# EAGLE design NFC-WiFi (EAGLE 9.1.3)
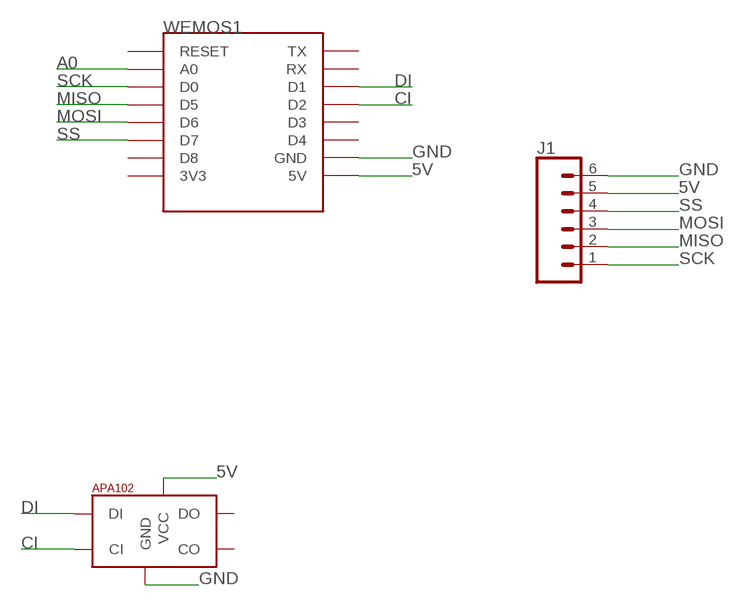
[diagram p0: schematic, sheet 1]

## Parts
J1  CONN_06SILK_FEMALE_PTH  [1X06]
U$1  APA1025050  [APA102_5050]
WEMOS1  WEMOS-D1-MINI  [WEMOS-D1-MINI]

## Nets
5V: J1.5 U$1.1(VCC) WEMOS1.5V
A0: WEMOS1.A0
CI: U$1.5(CI) WEMOS1.D2
DI: U$1.4(DI) WEMOS1.D1
GND: J1.6 U$1.6(GND) WEMOS1.GND
MISO: J1.2 WEMOS1.D5
MOSI: J1.3 WEMOS1.D6
SCK: J1.1 WEMOS1.D0
SS: J1.4 WEMOS1.D7
Unconnected: U$1.2(CO) U$1.3(DO) WEMOS1.3V3 WEMOS1.D3 WEMOS1.D4 WEMOS1.D8 WEMOS1.RESET WEMOS1.RX WEMOS1.TX

## Library data of the parts
J1 = SparkFun-Connectors:CONN_06: Multi connection point. Often used as Generic Header-pin footprint for 0.1 inch spaced/style header connections On any of the 0.1 inch spaced packages, you can populate with these: Break Away Headers - Straight <https://www.sparkfun.com/products/116> (PRT-00116) Break Away Male Headers - Right Angle <https://www.sparkfun.com/products/553> (PRT-00553) Female Headers <https://www.sparkfun.com/products/115> (PRT-00115) Break Away Headers - Machine Pin <https://www.sparkfun.com/products/117> (PRT-00117) Break Away Female Headers - Swiss Machine Pin <https://www.sparkfun.com/products/743> (PRT-00743) Arduino Stackable Header - 6 Pin <https://www.sparkfun.com/products/9280> (PRT-09280) For SCREWTERMINALS and SPRING TERMINALS visit here: Screw Terimnals on SparkFun.com <https://www.sparkfun.com/search/results?term=Screw+Terminals> (5mm/3.5mm/2.54mm spacing) This device is also useful as a general connection point to wire up your design to another part of your project. Our various solder wires solder well into these plated through hole pads. Hook-Up Wire - Assortment (Stranded, 22 AWG) <https://www.sparkfun.com/products/11375> (PRT-11375) Hook-Up Wire - Assortment (Solid Core, 22 AWG) <https://www.sparkfun.com/products/11367> (PRT-11367) View the entire wire category on our website here <https://www.sparkfun.com/categories/141>; PROD_ID: CONN-08437
U$1 = jos-ph:APA102: APA102C 5050 RGB LED -- Adafruit DotStar Single LED Pixel Product Page: https://www.adafruit.com/products/2343 Datasheet: https://cdn-shop.adafruit.com/product-files/2343/APA102C.pdf
WEMOS1 = esp8266modules:WEMOS-D1-MINI: WeMos.cc D1 mini ESP8266 module

## Board
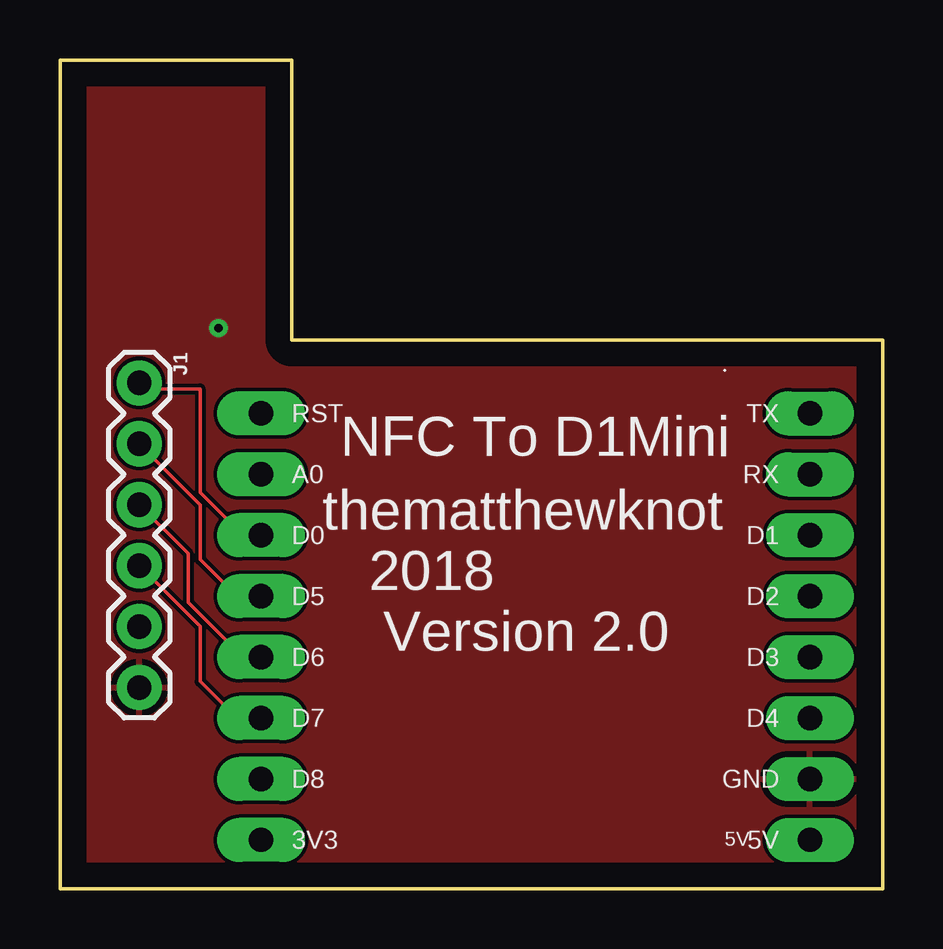
[diagram p1: board, top side]
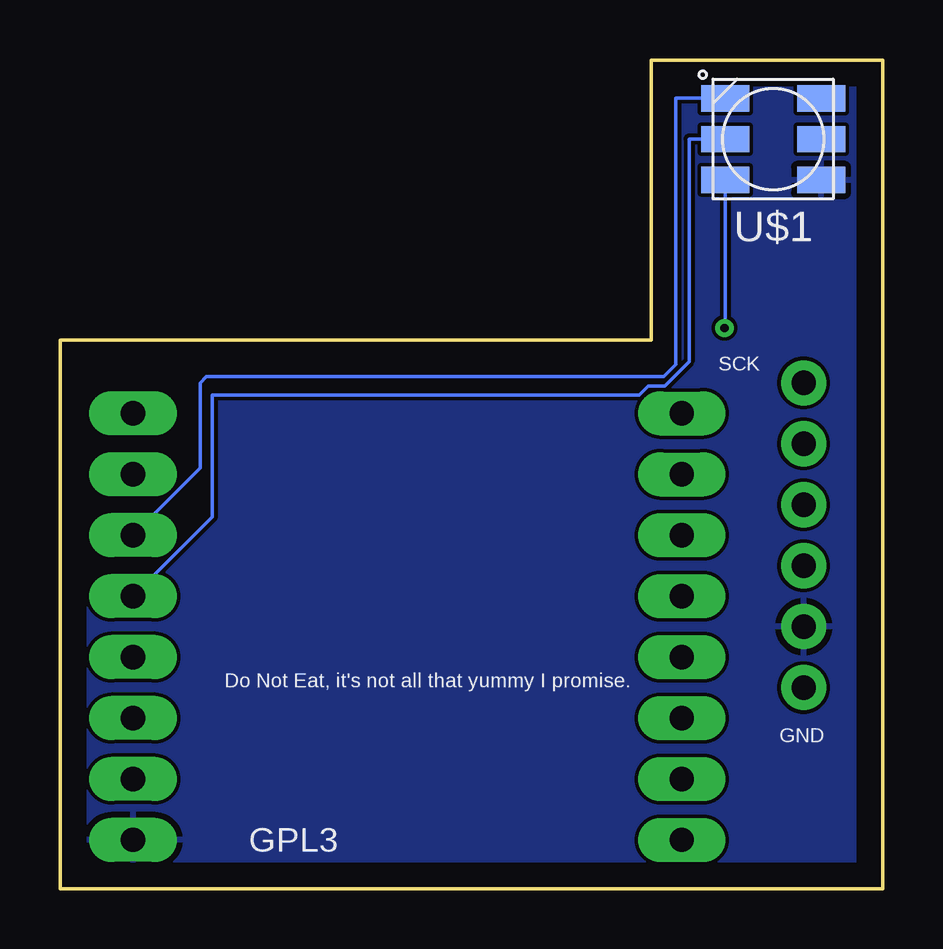
[diagram p2: board, bottom side, seen from below]

Size 34.29 x 34.54 mm. Coordinates in mm from the lower left corner, seen from the top.
Outline: 0,34.54 0,0 34.29,0 34.29,22.86 9.65,22.86 9.65,34.54 0,34.54
Copper layers (1*16): Top 0.035mm / dielectric 1.5mm / Bottom 0.035mm
Design rules "default": minimum track width 6mil, minimum drill 0.35mm, track to track 6mil, track to pad 6mil, pad to pad 6mil, via to via 6mil, smd to smd 6mil, copper to edge 40mil, drill to drill 6mil, minimum pad ring 10mil, minimum via ring 8mil, stop-mask expansion 4mil, vias tented up to drill 0mil, thermal gap 10mil

### Footprints (pad centres in the part's own frame; a part is rotated, then mirrored left to right if it is on the bottom)
1X06 = drill 1.016 pad 1.88: 1 0,0; 2 2.54,0; 3 5.08,0; 4 7.62,0; 5 10.16,0; 6 12.7,0
APA102_5050 = smd 2 x 1.1: 1 2,-1.7; 2 2,0; 3 2,1.7; 4 -2,1.7; 5 -2,0; 6 -2,-1.7
WEMOS-D1-MINI = drill 1.016 pad 1.829 long: 3V3 -10.16,-10.16; 5V 12.7,-10.16; A0 -10.16,5.08; D0 -10.16,2.54; D1 12.7,2.54; D2 12.7,0; D3 12.7,-2.54; D4 12.7,-5.08; D5 -10.16,0; D6 -10.16,-2.54; D7 -10.16,-5.08; D8 -10.16,-7.62; GND 12.7,-7.62; RESET -10.16,7.62; RX 12.7,5.08; TX 12.7,7.62

### Placement (x,y rotation side)
J1  3.3,21.08 270 top
U$1  4.57,31.24 0 bottom
WEMOS1  18.54,12.19 0 top

### Tracks (layer width: path | path; a pad name or v marks a point on that pad's centre or on a via)
5V
  pour Bottom: -3.56,35.05 38.35,35.05 38.61,34.8 38.61,-8.89 37.08,-10.41 -3.05,-10.41 -3.3,-10.16 -3.3,34.8
A0
  Bottom 0.152: 9.14,17.27 WEMOS1.A0
CI
  Bottom 0.152: U$1.5 8.08,31.24 8.08,21.97 9.09,20.96 9.77,20.96 10.15,20.57 27.94,20.57 27.94,15.49 WEMOS1.D2
DI
  Bottom 0.152: U$1.4 8.64,32.94 8.64,21.84 9.14,21.34 28.19,21.34 28.45,21.08 28.45,17.53 WEMOS1.D1
GND  (via drill 0.35)
  Bottom 0.152: U$1.6 6.57,23.4 v6.6,23.37
  pour Top: -4.83,35.81 -4.83,-12.19 -4.57,-12.45 40.39,-12.45 40.64,-12.7 40.64,37.08 -3.56,37.08
MISO
  Top 0.152: J1.2 5.84,16 5.84,13.72 7.37,12.19 WEMOS1.D5
MOSI
  Top 0.152: J1.3 5.33,13.97 5.33,11.94 7.62,9.65 WEMOS1.D6
SCK
  Top 0.152: J1.1 3.56,20.83 5.84,20.83 5.84,16.51 7.62,14.73 WEMOS1.D0
SS
  Top 0.152: J1.4 5.84,10.92 5.84,8.64 7.37,7.11 WEMOS1.D7

### Text on the board
tPlace: NFC To D1Mini | thematthewknot / 2018 | Version 2.0 | 5V
bPlace: SCK | Do Not Eat, it's not all that yummy I promise. | GND | GPL3